# Altium schematic sheet solarpower.SchDoc
size A
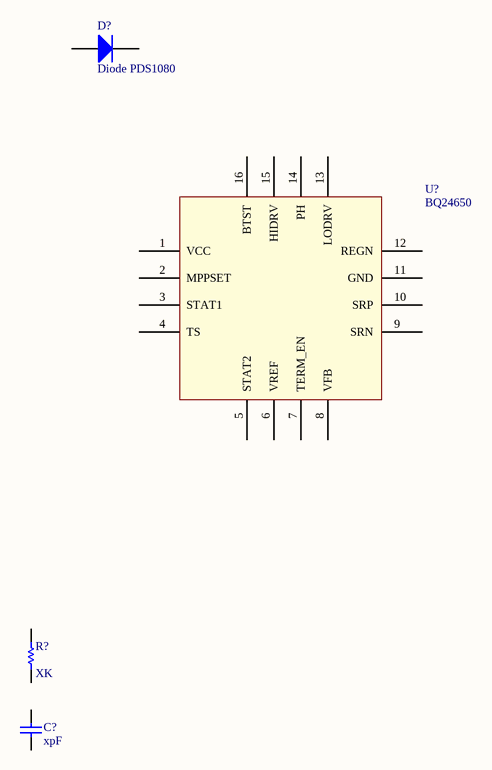
[diagram p0: solarpower.SchDoc]

## Parts
C?  value xpF  [1608[0603]]  (hidden comment: Cap Semi)
D?  Diode PDS1080  [DO-41]
R?  value XK  [1608[0603]]  (hidden comment: Res1)
U?  BQ24650

## Nets

Not connected (* = marked no-connect by the designer): C? 1 2; D? 1(A) 2(K); R? 1 2; U? 1(VCC) 2(MPPSET) 3(STAT1) 4(TS) 5(STAT2) 6(VREF) 7(TERM_EN) 8(VFB) 9(SRN) 10(SRP) 11(GND) 12(REGN) 13(LODRV) 14(PH) 15(HIDRV) 16(BTST)

## Library data of the parts
C? = Cap Semi: Capacitor (Semiconductor SIM Model); Published: 8-Jun-2000; LatestRevisionDate: 29-May-2009; LatestRevisionNote: IPC-7351 Footprint Added.; PackageReference: C1206; Publisher: Altium Limited; PackageDescription: Chip Capacitor
D? = Diode 1N4002: 1 Amp General Purpose Rectifier; Published: 8-Jun-2000; LatestRevisionDate: 17-Jul-2002; LatestRevisionNote: Re-released for DXP Platform.; DatasheetVersion: 1998; PackageVersion: Aug-1999; PackageReference: DO-41; Publisher: Altium Limited; PackageDescription: Diode, Axial; Body 5.2 x 2.7 mm (LxDia. max), Lead Dia. 0.86 mm (max); Code_JEDEC: DO-204-AL; ComponentLink1Description: Manufacturer Link; ComponentLink1URL: http://www.fairchildsemi.com/; ComponentLink2Description: Datasheet; ComponentLink2URL: http://www.fairchildsemi.com/ds/1N%2F1N4001.pdf
R? = Res1: Resistor; Published: 8-Jun-2000; LatestRevisionDate: 17-Jul-2002; LatestRevisionNote: Re-released for DXP Platform.; PackageReference: AXIAL-0.3; Publisher: Altium Limited; PackageDescription: Axial Device, Thru-Hole; 2 Leads; 0.3 in Pin Spacing